# EAGLE schematic Modular E-Fuse rev1 (EAGLE 9.6.2)
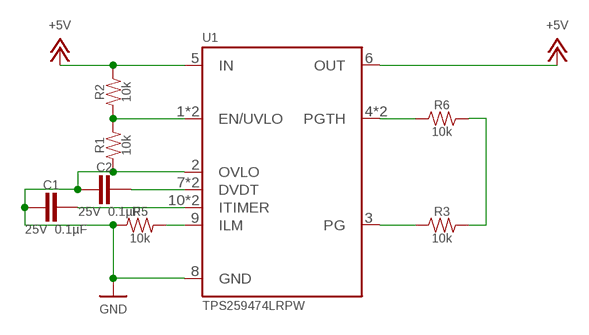
[diagram p0: schematic, sheet 1]

## Parts
C1  CAPACITOR_0603_25V_0.1UF  [0603-CAP]
C2  CAPACITOR_0603_25V_0.1UF  [0603-CAP]
R1  RESISTOR_0603_10K  [0603-RES]
R2  RESISTOR_0603_10K  [0603-RES]
R3  RESISTOR_0603_10K  [0603-RES]
R5  RESISTOR_0603_10K  [0603-RES]
R6  RESISTOR_0603_10K  [0603-RES]
U1  TPS259474LRPW  [VQFN-HR-10]

## Nets
+5V: R2.2 U1.5(IN) U1.6(OUT)
GND: C1.2 C2.2 R1.1 R5.1 U1.2(OVLO) U1.8(GND)
N$1: R1.2 R2.1 U1.1(EN/UVLO) U1.1@2(EN/UVLO)
N$3: C2.1 U1.7(DVDT) U1.7@2(DVDT)
N$4: C1.1 U1.10(ITIMER) U1.10@2(ITIMER)
N$5: R5.2 U1.9(ILM)
N$6: R3.1 U1.3(PG)
N$7: R6.1 U1.4(PGTH) U1.4@2(PGTH)
N$9: R3.2 R6.2

## Library data of the parts
C1 C2 = HyTechDevices:CAPACITOR_?_*: Capacitor, Non-Polarized VJ...1BC Series Datasheet <https://www.mouser.com/datasheet/2/427/vjw1bcbascomseries-1762447.pdf> Samsung Datasheet <https://www.mouser.com/datasheet/2/585/MLCC-1837944.pdf> Walsin Datasheet <https://www.mouser.com/datasheet/2/210/WTC_MLCC_General_Purpose-1534899.pdf> GRM188R61A226ME15D <https://www.mouser.com/datasheet/2/281/1/GRM188R61A226ME15_02A-1985787.pdf> GRM188R61E106MA73D <https://www.mouser.com/datasheet/2/281/1/GRM188R61E106MA73_01A-1985806.pdf> 885012006013 <https://www.mouser.com/datasheet/2/445/885012006013-1726946.pdf>; CAPACITANCE: 0.1µF; DKPN: 1276-1006-1-ND; MANUFACTURER: Samsung Electro-Mechanics; MOPN: 187-CL10B104KA8NNNC; MPN: CL10B104KA8NNNC; TOLERANCE: 10%; VOLTAGE: 25V
R1-R3 R5 R6 = HyTechDevices:RESISTOR_?_*: Resistor PWR163 Series <https://www.mouser.com/datasheet/2/54/pwr163-777985.pdf> AC Series <https://www.mouser.com/datasheet/2/447/Yageo_PYu_AC_51_RoHS_L_7_1714230-1874691.pdf> PU Series <https://www.mouser.com/datasheet/2/447/PYu-PU_51_RoHS_L_6-1504619.pdf> ERA Series <https://www.mouser.com/datasheet/2/315/AOA0000C307-1149632.pdf>; DKPN: 311-10.0KHRCT-ND; MANUFACTURER: Yageo; MOPN: 603-RC0603FR-0710KL; MPN: RC0603FR-0710KL; POWER: 0.1W; RESISTANCE: 10k; TOLERANCE: 1%; VOLTAGE: 75V
U1 = HyTechDevices:TPS259474LRPW: TPS259474x E-Fuse Datasheet <https://www.ti.com/lit/ds/symlink/tps25947.pdf?ts=1611163131190&ref_url=https%253A%252F%252Fwww.google.com%252F> Note: See page 32 for application schematic.; MPN: TPS259474LRPW